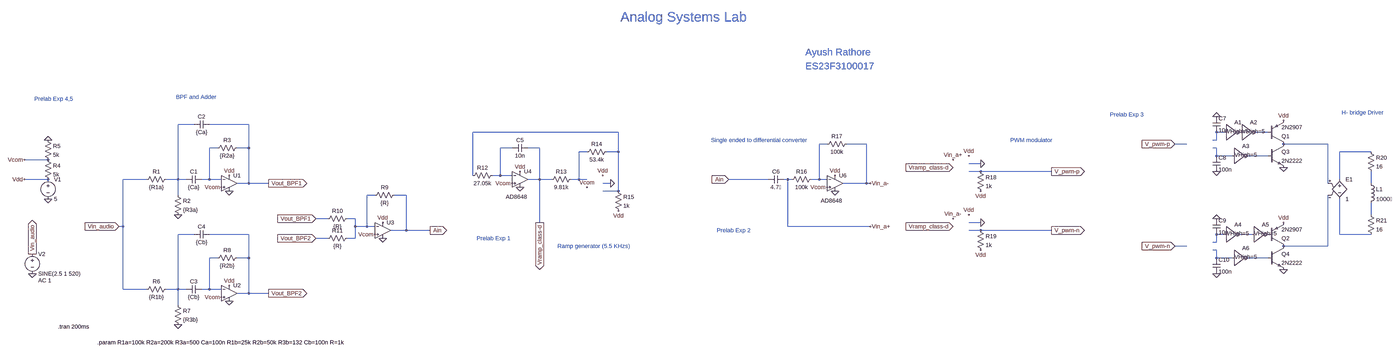
[diagram p0: schematic Top Notch Integration ANLG VI.asc, whole sheet]
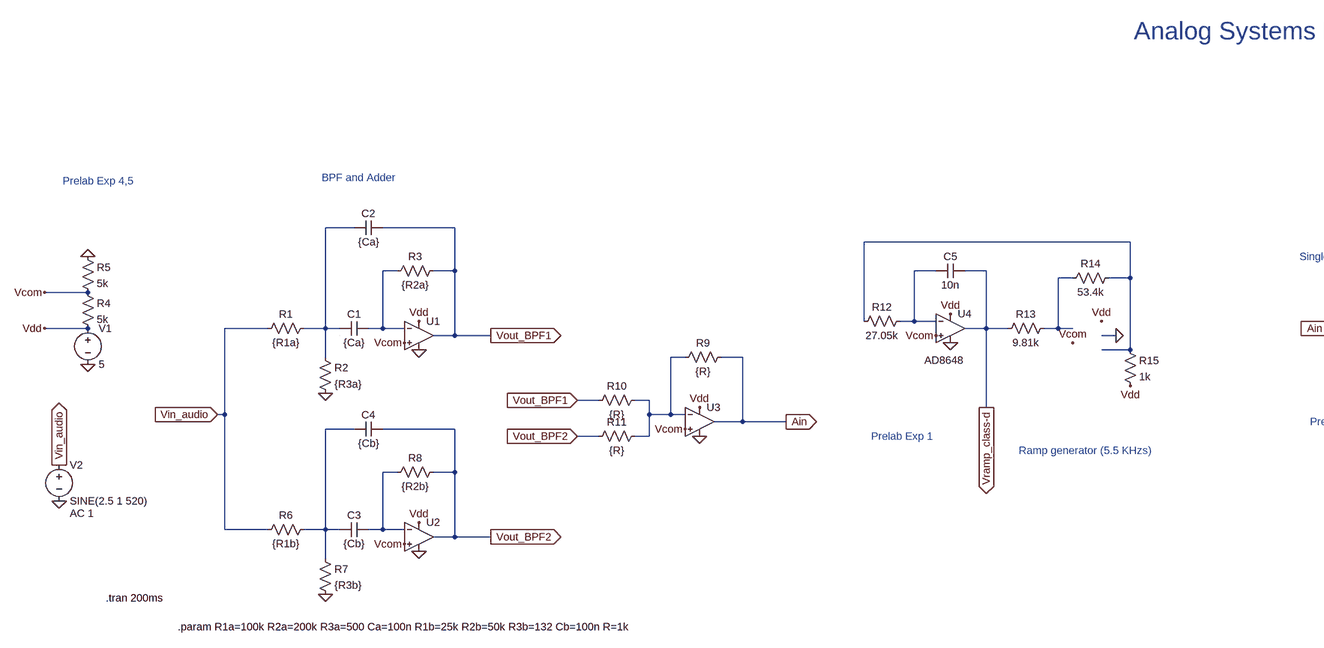
[diagram p1: schematic Top Notch Integration ANLG VI.asc, part, row 1 of 1, column 1 of 2]
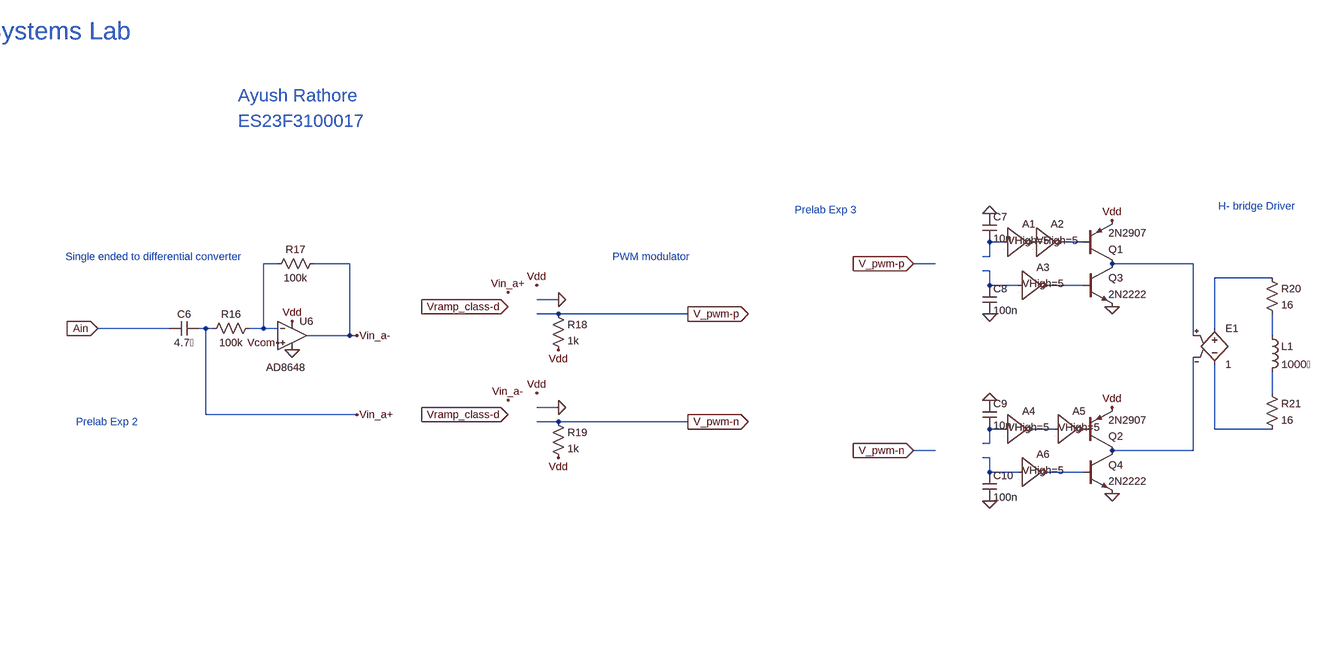
[diagram p2: schematic Top Notch Integration ANLG VI.asc, part, row 1 of 1, column 2 of 2]
Top Notch Integration ANLG VI.asc, the LTspice schematic file:
Version 4.1
SHEET 1 3872 1876
WIRE -1440 -1136 -1504 -1136
WIRE -1216 -1136 -1376 -1136
WIRE 464 -1104 -128 -1104
WIRE 3120 -1104 3088 -1104
WIRE 3296 -1104 3248 -1104
WIRE 3088 -1072 3088 -1104
WIRE 3088 -1072 3072 -1072
WIRE 1312 -1056 1280 -1056
WIRE 1472 -1056 1392 -1056
WIRE 2960 -1056 2912 -1056
WIRE 3600 -1056 3360 -1056
WIRE -1344 -1040 -1376 -1040
WIRE -1216 -1040 -1216 -1136
WIRE -1216 -1040 -1264 -1040
WIRE 32 -1040 -16 -1040
WIRE 144 -1040 96 -1040
WIRE 3088 -1040 3072 -1040
WIRE 336 -1024 304 -1024
WIRE 464 -1024 464 -1104
WIRE 464 -1024 416 -1024
WIRE 3776 -1024 3648 -1024
WIRE 3088 -1008 3088 -1040
WIRE 3152 -1008 3088 -1008
WIRE 3296 -1008 3216 -1008
WIRE -2032 -992 -2128 -992
WIRE 1936 -976 1888 -976
WIRE 1936 -944 1888 -944
WIRE 2224 -944 1936 -944
WIRE -128 -928 -128 -1104
WIRE -16 -928 -16 -1040
WIRE -16 -928 -48 -928
WIRE 32 -928 -16 -928
WIRE -2032 -912 -2128 -912
WIRE -1632 -912 -1728 -912
WIRE -1504 -912 -1504 -1136
WIRE -1504 -912 -1552 -912
WIRE -1472 -912 -1504 -912
WIRE -1376 -912 -1376 -1040
WIRE -1376 -912 -1408 -912
WIRE -1328 -912 -1376 -912
WIRE 144 -912 144 -1040
WIRE 144 -912 96 -912
WIRE 192 -912 144 -912
WIRE 304 -912 304 -1024
WIRE 304 -912 272 -912
WIRE 336 -912 304 -912
WIRE 1072 -912 912 -912
WIRE 1152 -912 1136 -912
WIRE 1168 -912 1152 -912
WIRE 1280 -912 1280 -1056
WIRE 1280 -912 1248 -912
WIRE 1312 -912 1280 -912
WIRE 3648 -912 3648 -1024
WIRE -1216 -896 -1216 -1040
WIRE -1216 -896 -1264 -896
WIRE -1136 -896 -1216 -896
WIRE 432 -896 400 -896
WIRE 1472 -896 1472 -1056
WIRE 1472 -896 1376 -896
WIRE 1488 -896 1472 -896
WIRE 3600 -896 3600 -1056
WIRE 3776 -896 3776 -944
WIRE 464 -864 464 -1024
WIRE 464 -864 400 -864
WIRE -1504 -848 -1504 -912
WIRE -704 -848 -736 -848
WIRE -576 -848 -624 -848
WIRE 3776 -768 3776 -816
WIRE -896 -752 -944 -752
WIRE -784 -752 -816 -752
WIRE 144 -736 144 -912
WIRE 1936 -736 1888 -736
WIRE -1728 -720 -1728 -912
WIRE -1728 -720 -1744 -720
WIRE -784 -720 -784 -752
WIRE -736 -720 -736 -848
WIRE -736 -720 -784 -720
WIRE -704 -720 -736 -720
WIRE 1152 -720 1152 -912
WIRE 1488 -720 1152 -720
WIRE -576 -704 -576 -848
WIRE -576 -704 -640 -704
WIRE -480 -704 -576 -704
WIRE 1936 -704 1888 -704
WIRE 2224 -704 1936 -704
WIRE -1440 -688 -1504 -688
WIRE -1216 -688 -1376 -688
WIRE 3120 -688 3088 -688
WIRE 3232 -688 3184 -688
WIRE 3648 -688 3648 -832
WIRE 3776 -688 3648 -688
WIRE -896 -672 -944 -672
WIRE -784 -672 -784 -720
WIRE -784 -672 -816 -672
WIRE 3088 -656 3088 -688
WIRE 3088 -656 3072 -656
WIRE 2960 -640 2912 -640
WIRE 3600 -640 3600 -848
WIRE 3600 -640 3360 -640
WIRE 3088 -624 3072 -624
WIRE -1344 -592 -1376 -592
WIRE -1216 -592 -1216 -688
WIRE -1216 -592 -1264 -592
WIRE 3088 -592 3088 -624
WIRE 3152 -592 3088 -592
WIRE 3296 -592 3216 -592
WIRE -1728 -464 -1728 -720
WIRE -1632 -464 -1728 -464
WIRE -1504 -464 -1504 -688
WIRE -1504 -464 -1552 -464
WIRE -1472 -464 -1504 -464
WIRE -1376 -464 -1376 -592
WIRE -1376 -464 -1408 -464
WIRE -1328 -464 -1376 -464
WIRE -1216 -448 -1216 -592
WIRE -1216 -448 -1264 -448
WIRE -1136 -448 -1216 -448
WIRE -1504 -400 -1504 -464
FLAG -1296 -864 0
FLAG -1504 -768 0
FLAG -2032 -832 0
FLAG -2032 -1072 0
FLAG -1296 -416 0
FLAG -1504 -320 0
FLAG -1136 -896 Vout_BPF1
IOPIN -1136 -896 Out
FLAG -1136 -448 Vout_BPF2
IOPIN -1136 -448 Out
FLAG -1744 -720 Vin_audio
IOPIN -1744 -720 In
FLAG -2128 -992 Vcom
FLAG -1328 -880 Vcom
FLAG -1328 -432 Vcom
FLAG -2128 -912 Vdd
FLAG -1296 -480 Vdd
FLAG -1296 -928 Vdd
FLAG -2096 -528 0
FLAG -2096 -608 Vin_audio
IOPIN -2096 -608 Out
FLAG -944 -752 Vout_BPF1
IOPIN -944 -752 In
FLAG -944 -672 Vout_BPF2
IOPIN -944 -672 In
FLAG -672 -736 Vdd
FLAG -672 -672 0
FLAG -704 -688 Vcom
FLAG 64 -880 0
FLAG 432 -896 0
FLAG 64 -944 Vdd
FLAG 400 -928 Vdd
FLAG 32 -896 Vcom
FLAG 336 -880 Vcom
FLAG 464 -784 Vdd
FLAG 144 -736 Vramp_class-d
IOPIN 144 -736 Out
FLAG 1312 -880 Vcom
FLAG 1344 -864 0
FLAG 1344 -928 Vdd
FLAG 1488 -896 Vin_a-
FLAG 1488 -720 Vin_a+
FLAG 912 -912 Ain
IOPIN 912 -912 In
FLAG 1824 -992 Vin_a+
FLAG 1824 -752 Vin_a-
FLAG 1888 -1008 Vdd
FLAG 1888 -768 Vdd
FLAG 1936 -976 0
FLAG 1936 -736 0
FLAG 1936 -864 Vdd
FLAG 1936 -624 Vdd
FLAG 2224 -944 V_pwm-p
IOPIN 2224 -944 Out
FLAG 2224 -704 V_pwm-n
IOPIN 2224 -704 Out
FLAG 1824 -960 Vramp_class-d
IOPIN 1824 -960 In
FLAG 1824 -720 Vramp_class-d
IOPIN 1824 -720 In
FLAG 3360 -1152 Vdd
FLAG 3360 -736 Vdd
FLAG 3360 -960 0
FLAG 3360 -544 0
FLAG 3088 -1168 0
FLAG 3088 -944 0
FLAG 3088 -752 0
FLAG 3088 -528 0
FLAG 2912 -1056 V_pwm-p
IOPIN 2912 -1056 In
FLAG 2912 -640 V_pwm-n
IOPIN 2912 -640 In
FLAG -480 -704 Ain
IOPIN -480 -704 Out
SYMBOL res -1536 -928 R90
WINDOW 0 0 56 VBottom 2
WINDOW 3 32 56 VTop 2
SYMATTR InstName R1
SYMATTR Value {R1a}
SYMBOL res -1520 -864 R0
SYMATTR InstName R2
SYMATTR Value {R3a}
SYMBOL cap -1472 -928 M90
WINDOW 0 0 32 VBottom 2
WINDOW 3 32 32 VTop 2
SYMATTR InstName C1
SYMATTR Value {Ca}
SYMBOL cap -1440 -1152 M90
WINDOW 0 0 32 VBottom 2
WINDOW 3 32 32 VTop 2
SYMATTR InstName C2
SYMATTR Value {Ca}
SYMBOL res -1248 -1056 R90
WINDOW 0 0 56 VBottom 2
WINDOW 3 32 56 VTop 2
SYMATTR InstName R3
SYMATTR Value {R2a}
SYMBOL OpAmps\\UniversalOpAmp2 -1296 -896 R0
SYMATTR InstName U1
SYMBOL voltage -2032 -928 R0
WINDOW 123 0 0 Left 0
WINDOW 39 0 0 Left 0
SYMATTR InstName V1
SYMATTR Value 5
SYMBOL res -2048 -1008 R0
SYMATTR InstName R4
SYMATTR Value 5k
SYMBOL res -2048 -1088 R0
SYMATTR InstName R5
SYMATTR Value 5k
SYMBOL res -1536 -480 R90
WINDOW 0 0 56 VBottom 2
WINDOW 3 32 56 VTop 2
SYMATTR InstName R6
SYMATTR Value {R1b}
SYMBOL res -1520 -416 R0
SYMATTR InstName R7
SYMATTR Value {R3b}
SYMBOL cap -1472 -480 M90
WINDOW 0 0 32 VBottom 2
WINDOW 3 32 32 VTop 2
SYMATTR InstName C3
SYMATTR Value {Cb}
SYMBOL cap -1440 -704 M90
WINDOW 0 0 32 VBottom 2
WINDOW 3 32 32 VTop 2
SYMATTR InstName C4
SYMATTR Value {Cb}
SYMBOL res -1248 -608 R90
WINDOW 0 0 56 VBottom 2
WINDOW 3 32 56 VTop 2
SYMATTR InstName R8
SYMATTR Value {R2b}
SYMBOL OpAmps\\UniversalOpAmp2 -1296 -448 R0
SYMATTR InstName U2
SYMBOL voltage -2096 -624 R0
WINDOW 123 24 124 Left 2
WINDOW 39 0 0 Left 0
SYMATTR Value2 AC 1
SYMATTR InstName V2
SYMATTR Value SINE(2.5 1 520)
SYMBOL OpAmps\\UniversalOpAmp2 -672 -704 R0
SYMATTR InstName U3
SYMBOL res -608 -864 R90
WINDOW 0 0 56 VBottom 2
WINDOW 3 32 56 VTop 2
SYMATTR InstName R9
SYMATTR Value {R}
SYMBOL res -800 -768 R90
WINDOW 0 0 56 VBottom 2
WINDOW 3 32 56 VTop 2
SYMATTR InstName R10
SYMATTR Value {R}
SYMBOL res -800 -688 R90
WINDOW 0 0 56 VBottom 2
WINDOW 3 32 56 VTop 2
SYMATTR InstName R11
SYMATTR Value {R}
SYMBOL OpAmps\\AD8648 64 -976 R0
WINDOW 3 -58 135 Left 2
SYMATTR InstName U4
SYMBOL res -32 -944 R90
WINDOW 0 0 56 VBottom 2
WINDOW 3 32 56 VTop 2
SYMATTR InstName R12
SYMATTR Value 27.05k
SYMBOL res 288 -928 R90
WINDOW 0 0 56 VBottom 2
WINDOW 3 32 56 VTop 2
SYMATTR InstName R13
SYMATTR Value 9.81k
SYMBOL res 432 -1040 R90
WINDOW 0 0 56 VBottom 2
WINDOW 3 32 56 VTop 2
SYMATTR InstName R14
SYMATTR Value 53.4k
SYMBOL cap 96 -1056 R90
WINDOW 0 0 32 VBottom 2
WINDOW 3 32 32 VTop 2
SYMATTR InstName C5
SYMATTR Value 10n
SYMBOL res 448 -880 R0
SYMATTR InstName R15
SYMATTR Value 1k
SYMBOL cap 1136 -928 R90
WINDOW 0 0 32 VBottom 2
WINDOW 3 32 32 VTop 2
SYMATTR InstName C6
SYMATTR Value 4.7�
SYMBOL res 1264 -928 R90
WINDOW 0 0 56 VBottom 2
WINDOW 3 32 56 VTop 2
SYMATTR InstName R16
SYMATTR Value 100k
SYMBOL OpAmps\\AD8648 1344 -960 R0
WINDOW 3 -58 135 Left 2
SYMATTR InstName U6
SYMBOL res 1408 -1072 R90
WINDOW 0 0 56 VBottom 2
WINDOW 3 32 56 VTop 2
SYMATTR InstName R17
SYMATTR Value 100k
SYMBOL res 1920 -960 R0
SYMATTR InstName R18
SYMATTR Value 1k
SYMBOL res 1920 -720 R0
SYMATTR InstName R19
SYMATTR Value 1k
SYMBOL Digital\\inv 3120 -1168 R0
WINDOW 123 8 60 Left 2
SYMATTR Value2 VHigh=5
SYMATTR InstName A1
SYMBOL Digital\\inv 3184 -1168 R0
WINDOW 123 8 60 Left 2
SYMATTR Value2 VHigh=5
SYMATTR InstName A2
SYMBOL Digital\\inv 3152 -1072 R0
WINDOW 123 8 60 Left 2
SYMATTR Value2 VHigh=5
SYMATTR InstName A3
SYMBOL Digital\\inv 3120 -752 R0
WINDOW 123 8 60 Left 2
SYMATTR Value2 VHigh=5
SYMATTR InstName A4
SYMBOL Digital\\inv 3232 -752 R0
WINDOW 123 8 60 Left 2
SYMATTR Value2 VHigh=5
SYMATTR InstName A5
SYMBOL Digital\\inv 3152 -656 R0
WINDOW 123 8 60 Left 2
SYMATTR Value2 VHigh=5
SYMATTR InstName A6
SYMBOL pnp 3296 -1056 M180
SYMATTR InstName Q1
SYMATTR Value 2N2907
SYMBOL pnp 3296 -640 M180
SYMATTR InstName Q2
SYMATTR Value 2N2907
SYMBOL npn 3296 -1056 R0
SYMATTR InstName Q3
SYMATTR Value 2N2222
SYMBOL npn 3296 -640 R0
SYMATTR InstName Q4
SYMATTR Value 2N2222
SYMBOL res 3760 -1040 R0
SYMATTR InstName R20
SYMATTR Value 16
SYMBOL res 3760 -784 R0
SYMATTR InstName R21
SYMATTR Value 16
SYMBOL ind 3760 -912 R0
SYMATTR InstName L1
SYMATTR Value 1000�
SYMBOL cap 3072 -1168 R0
SYMATTR InstName C7
SYMATTR Value 10n
SYMBOL cap 3072 -1008 R0
SYMATTR InstName C8
SYMATTR Value 100n
SYMBOL cap 3072 -752 R0
SYMATTR InstName C9
SYMATTR Value 10n
SYMBOL cap 3072 -592 R0
SYMATTR InstName C10
SYMATTR Value 100n
SYMBOL e 3648 -928 R0
SYMATTR InstName E1
SYMATTR Value 1
TEXT -1992 -312 Left 2 !.tran 200ms
TEXT -1832 -248 Left 2 !.param R1a=100k R2a=200k R3a=500 Ca=100n R1b=25k R2b=50k R3b=132 Cb=100n R=1k
TEXT -2088 -1240 Left 2 ;Prelab Exp 4,5
TEXT -112 -672 Left 2 ;Prelab Exp 1
TEXT 864 -704 Left 2 ;Prelab Exp 2
TEXT 2648 -1176 Left 2 ;Prelab Exp 3
TEXT -1512 -1248 Left 2 ;BPF and Adder
TEXT 216 -640 Left 2 ;Ramp generator (5.5 KHzs)
TEXT 2056 -1072 Left 2 ;PWM modulator
TEXT 840 -1072 Left 2 ;Single ended to differential converter
TEXT 3656 -1184 Left 2 ;H- bridge Driver
TEXT 472 -1768 Left 5 ;Analog Systems Lab
TEXT 1224 -1624 Left 4 ;Ayush Rathore
TEXT 1224 -1568 Left 4 ;ES23F3100017
RECTANGLE Normal -1472 -896 -1472 -896 2

The netlist it stands for:
* Top Notch Integration ANLG VI.asc
R1 N001 Vin_audio {R1a}
R2 N001 0 {R3a}
C1 N001 N007 {Ca}
C2 N001 Vout_BPF1 {Ca}
R3 Vout_BPF1 N007 {R2a}
X§U1 Vcom N007 Vdd 0 Vout_BPF1 level2 Avol=1Meg GBW=10Meg Slew=10Meg Ilimit=25m Rail=0 Vos=0 En=0 Enk=0 In=0 Ink=0 Rin=500Meg  ; pins In+ In- V+ V- OUT
V1 Vdd 0 5
R4 Vcom Vdd 5k
R5 0 Vcom 5k
R6 N016 Vin_audio {R1b}
R7 N016 0 {R3b}
C3 N016 N022 {Cb}
C4 N016 Vout_BPF2 {Cb}
R8 Vout_BPF2 N022 {R2b}
X§U2 Vcom N022 Vdd 0 Vout_BPF2 level2 Avol=1Meg GBW=10Meg Slew=10Meg Ilimit=25m Rail=0 Vos=0 En=0 Enk=0 In=0 Ink=0 Rin=500Meg  ; pins In+ In- V+ V- OUT
V2 Vin_audio 0 SINE(2.5 1 520) AC 1
X§U3 Vcom N014 Vdd 0 Ain level2 Avol=1Meg GBW=10Meg Slew=10Meg Ilimit=25m Rail=0 Vos=0 En=0 Enk=0 In=0 Ink=0 Rin=500Meg  ; pins In+ In- V+ V- OUT
R9 Ain N014 {R}
R10 N014 Vout_BPF1 {R}
R11 N014 Vout_BPF2 {R}
X§U4 Vcom N008 Vdd 0 Vramp_class-d AD8648  ; pins In+ In- V+ V- OUT
R12 N008 N002 27.05k
R13 N010 Vramp_class-d 9.81k
R14 N002 N010 53.4k
C5 Vramp_class-d N008 10n
R15 N002 Vdd 1k
C6 Vin_a+ Ain 4.7�
R16 N005 Vin_a+ 100k
X§U6 Vcom N005 Vdd 0 Vin_a- AD8648  ; pins In+ In- V+ V- OUT
R17 Vin_a- N005 100k
R18 V_pwm-p Vdd 1k
R19 V_pwm-n Vdd 1k
A1 N003 0 0 0 0 P001 0 0 BUF VHigh=5
A2 P001 0 0 0 0 N004 0 0 BUF VHigh=5
A3 N009 0 0 0 0 N012 0 0 BUF VHigh=5
A4 N017 0 0 0 0 N018 0 0 BUF VHigh=5
A5 N018 0 0 0 0 P002 0 0 BUF VHigh=5
A6 N021 0 0 0 0 N023 0 0 BUF VHigh=5
Q1 N006 N004 Vdd 0 2N2907
Q2 N020 P002 Vdd 0 2N2907
Q3 N006 N012 0 0 2N2222
Q4 N020 N023 0 0 2N2222
R20 N011 N013 16
R21 N015 N019 16
L1 N013 N015 1000�
C7 0 N003 10n
C8 N009 0 100n
C9 0 N017 10n
C10 N021 0 100n
E1 N011 N019 N006 N020 1
.model NPN NPN
.model PNP PNP
.lib standard.bjt
.tran 200ms
.param R1a=100k R2a=200k R3a=500 Ca=100n R1b=25k R2b=50k R3b=132 Cb=100n R=1k
* Prelab Exp 4,5
* Prelab Exp 1
* Prelab Exp 2
* Prelab Exp 3
* BPF and Adder
* Ramp generator (5.5 KHzs)
* PWM modulator
* Single ended to differential converter
* H- bridge Driver
* Analog Systems Lab
* Ayush Rathore
* ES23F3100017
.lib UniversalOpAmp2.lib
.lib ADI.lib
.backanno
.end